# Altium schematic sheet buck_converters.SchDoc
size A4; SheetNumber: 3; SheetTotal: 3
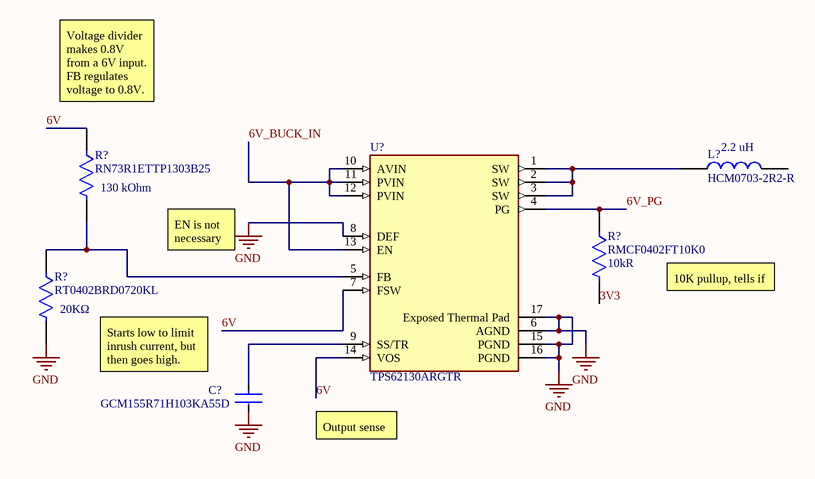
[diagram p0: buck_converters.SchDoc]

## Parts
(Parts that share a designator on the sheet are numbered #1, #2 ... from top to bottom, then left to right.)
C?  GCM155R71H103KA55D  [FP-GCM155-0_05-IPC_C]
L?  HCM0703-2R2-R  Inductance: 2.2 uH  [INDPM7166X300N]
R?#1  RN73R1ETTP1303B25  Parameter 1: 130 kOhm  [FP-RN73R1E-IPC_B]
R?#2  RMCF0402FT10K0  Resistance: 10kR  [FP-RMCF0402-IPC_C]
R?#3  RT0402BRD0720KL  Resistance: 20KΩ  [FP-RT0402-MFG]
U?  TPS62130ARGTR  [FP-RGT0016C-MFG]

## Nets
GND: C?.2 R?#3.2 U?.6(AGND) U?.8(DEF) U?.15(PGND) U?.16(PGND) U?.17(Exposed_Thermal_Pad)
3V3: R?#2.2
6V: R?#1.1 U?.7(FSW) U?.14(VOS)
6V_BUCK_IN: U?.10(AVIN) U?.11(PVIN) U?.12(PVIN) U?.13(EN)
6V_PG: R?#2.1 U?.4(PG)
NetC?_1: C?.1 U?.9(SS/TR)
NetL?_1: L?.1 U?.1(SW) U?.2(SW) U?.3(SW)
NetR?#1_2: R?#1.2 R?#3.1 U?.5(FB)

Not connected (* = marked no-connect by the designer): L? 2

## Notes on the sheet
- Voltage divider makes 0.8V from a 6V input. FB regulates voltage to 0.8V.
- EN is not necessary and added complexity since the motor driver has control as well
- 10K pullup, tells if voltage falls too low
- Starts low to limit inrush current, but then goes high.
  goes from 2.5 MHz -> 1.25 MHz
- Output sense

## Library data of the parts
C? = CMP-2008-03723-3: Ceramic Capacitor for Automotive 10nF ±10% 50VDC X7R 0402 Paper T/R; Voltage Rating (DC): 50V; Min Operating Temperature: -55°C; Radiation Hardening: No; Mount: Surface Mount; Thickness: 0.022inch; Package Quantity: 1; Case Code (Imperial): 0402; Lead Free: Lead Free; Case/Package: 0402; Depth: 0.5mm; Termination: SMD/SMT; Tolerance: 10%; Voltage: 50V; Packaging: Tape and Reel; Width: 0.02inch; REACH SVHC: No SVHC; Height: 0.5mm; Max Operating Temperature: 125°C; Case Code (Metric): 1005; Voltage Rating: 50V; Capacitance: 10nF; Ratings: AEC-Q200; Length: 1mm; Dielectric: X7R
L? = HCM0703-2R2-R: High current carrying capacity  Low core losses  Magnetically shielded, low EMI  Frequency range up to 5 MHz  Inductance range from 0.15 uH to 33 uH  Current range from 1.8 A to 52 A  7.4 mm x 6.8 mm footprint surface mount package in a 3.0 mm height  Iron powder core material; Manufacturer_Name: Eaton; Geometry.Height: 3mm; Manufacturer_Part_Number: HCM0703-2R2-R; Mouser Part Number: 704-HCM0703-2R2-R; Mouser Price/Stock: https://www.mouser.co.uk/ProductDetail/Coiltronics-Eaton/HCM0703-2R2-R?qs=NDsWxPllFnNWXZwyaLK1bg%3D%3D; Arrow Part Number: HCM0703-2R2-R; Arrow Price/Stock: null?region=nac; Datasheet Link: https://www.mouser.fr/datasheet/2/87/eaton_hcm0703_high_current_power_inductors_data_sh-1608742.pdf
R?#1 = CMP-04015-027314-1: 130kΩ ±0.1% 0.063W, 1/16W Chip Resistor 0402 (1005 Metric) Moisture Resistant Thin Film
R?#2 = CMP-26527-000128-1: 10kΩ ±1% 0.063W 0402 Thick Film Chip Resistor AEC-Q200 compliant; Temperature Coefficient: 100ppm/°C; Power Rating: 62.5mW; Max Power Dissipation: 63mW; Width: 0.02inch; Case/Package: 0402; Depth: 0.5mm; Resistor Type: Thick Film; Series: RMCF; Length: 1mm; Contact Plating: Tin; Tolerance: 1%; Number of Terminations: 2; Height: 0.016inch; Military Standard: Not; Case Code (Imperial): 0402; Size Code: 0402; Construction: Rectangular; Radiation Hardening: No; RoHS Compliant: Yes; Case Code (Metric): 1005; Packaging: Tape and Reel; Lead Free: Lead Free; Min Operating Temperature: -55°C; Max Operating Temperature: 155°C; Mount: Surface Mount; Features: Automotive AEC-Q200
R?#3 = CMP-2002-02936-2: RES SMD 20K OHM 0.1% 1/16W 0402; Manufacturer: Yageo; Power Rating: 0.063W; Value: 20KΩ; Tolerance: 0.001; Voltage Rating: 50V; Description: RT0402 20KΩ 0.063W 25 ppm/°C 0.10%; Temperature Coefficient: 25 ppm/°C; ComponentLink2Description: Datasheet; Footprint Url: http://www.yageo.com/exep/pages/download/literatures/PYu-R_Mount_10.pdf; Automotive: No; Manufacturer Part Number: RT0402BRD0720KL; Temperature Range Low: -55°C; Octopart: https://octopart.com/rt0402brd0720kl-yageo-1422805; Digikey Description: RES SMD 20K OHM 0.1% 1/16W 0402; Device Class L3: Chip SMD Resistors; Series: RT; Composition: Thin Film; Temperature: -55°C to +155°C; Lead Free: Yes; Height: 0.35mm; Package: RT0402; Mouser Description: Res Thin Film 0402 20K Ohm 0.1% 1/16W ±25ppm/°C Molded SMD SMD Paper T/R; Ipc Land Pattern Name: RESC10050X30; RoHS: TRUE; Device Class L1: Passive Components; Category: Res; Temperature Range High: +155°C; Device Class L2: Resistors; ComponentLink2URL: http://www.yageo.com/documents/recent/PYu-RT_1-to-0.01_RoHS_L_9.pdf
U? = CMP-04918-000067-1: IC REG BUCK ADJUSTABLE 3A 16QFN; Manufacturer: Texas Instruments; Min Supply Voltage: 3V; Max Junction Temp: +125°C; Standoff Height: 0mm; Max Duty Cycle: 100%; Max Supply Voltage: 17V; Nominal Supply Current: 17uA; Number Of Outputs: 1; Output Type: AdjustableProgrammable; Switching Frequency: 1250-2500kHz; Output Voltage: 0.9-6V; Automotive: No; Height: 1mm; Device Class L2: Power Management ICs; Output Current: 3A; Digikey Description: IC REG BUCK ADJUSTABLE 3A 16QFN; Temperature: -40°C to +125°C; Temperature Range High: +125°C; Octopart: https://octopart.com/tps62130argtr-texas+instruments-29716940; Switching Topology: Buck; Lead Free: Yes; Temperature Range Low: -40°C; Category: IC; Mouser Description: 3-V to 17-V, 3-A step-down converter with DCS-control in 3x3 QFN package 16-VQFN -40 to 125; ComponentLink2URL: http://www.ti.com/lit/ds/symlink/tps62130a.pdf; Package: RGT0016C; Device Class L1: Integrated Circuits (ICs); RoHS: TRUE; Manufacturer Part Number: TPS62130ARGTR; Device Class L3: Voltage Regulators - Switching; ComponentLink2Description: Datasheet